# EAGLE design main (EAGLE 9.6.2)

## Sheet 1 of 2
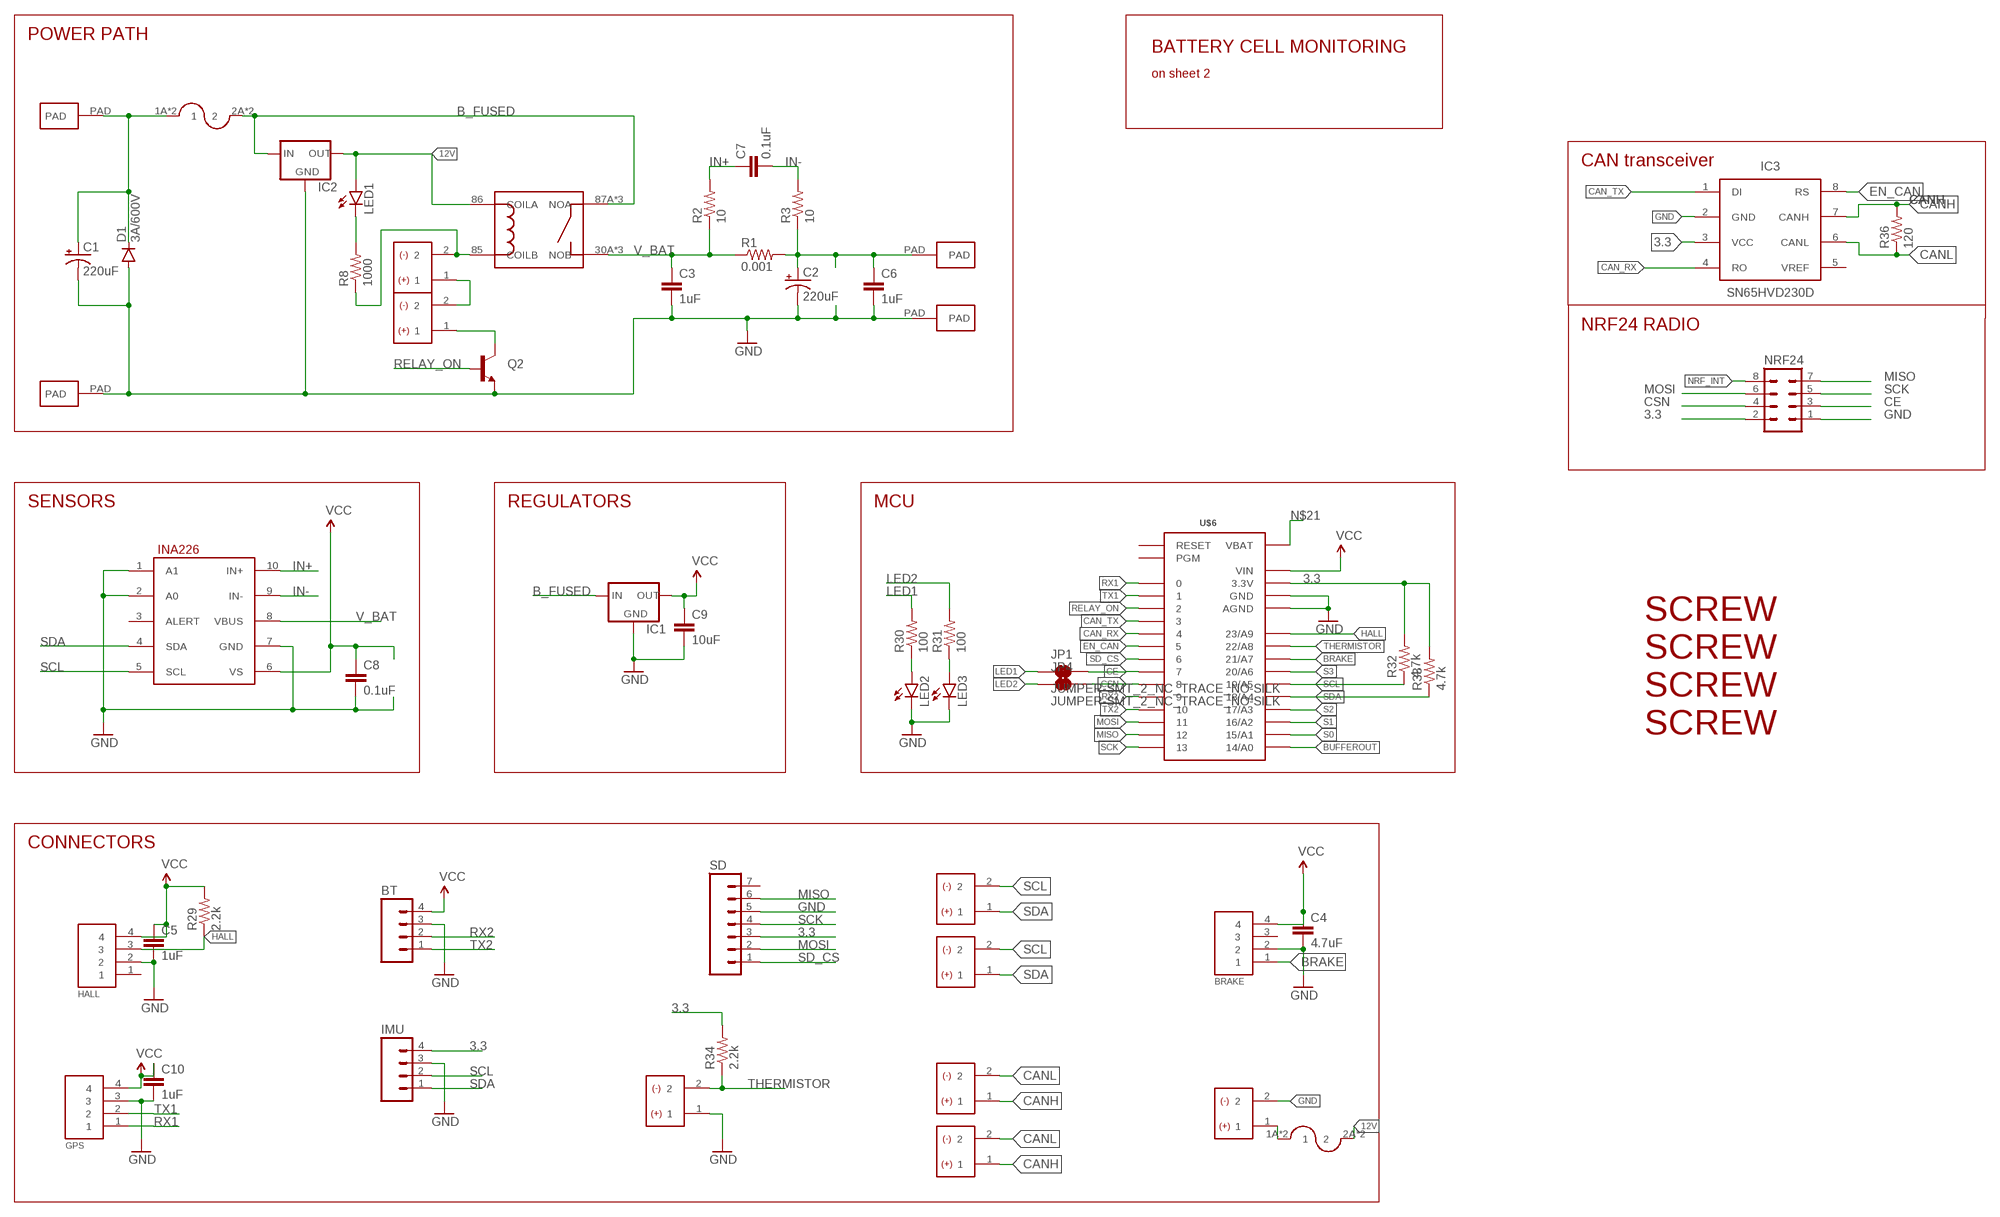
[diagram p0: schematic, sheet 1]

### Parts
12V  HEADER2  [2PINVALULOK]
BRAKE  HEADER4VALULOK  [4PINVALULOK]
BT  M04PTH  [1X04]
C1  220uF  CAP_POLPTH4  [CPOL-RADIAL-1000UF-25V]
C2  220uF  CAP_POLPTH4  [CPOL-RADIAL-1000UF-25V]
C3  1uF  CAP1206  [1206]
C4  4.7uF  CAP0603-CAP  [0603-CAP]
C5  1uF  CAP0603-CAP  [0603-CAP]
C6  1uF  CAP1206  [1206]
C7  0.1uF  CAP0603-CAP  [0603-CAP]
C8  0.1uF  CAP0603-CAP  [0603-CAP]
C9  10uF  CAP0805  [0805]
C10  1uF  CAP0603-CAP  [0603-CAP]
CAN1  HEADER2  [2PINVALULOK]
CAN2  HEADER2  [2PINVALULOK]
D1  3A/600V  DIODEES3J  [SMC]
ESTOP1  HEADER2  [2PINVALULOK]
ESTOP2  HEADER2  [2PINVALULOK]
GPS  GPS  HEADER4VALULOK  [4PINVALULOK]
HALL  HEADER4VALULOK  [4PINVALULOK]
I2C_1  HEADER2  [2PINVALULOK]
I2C_2  HEADER2  [2PINVALULOK]
IC1  V_REG_78XXSINK  [TO220-IGO]
IC2  V_REG_78XXSINK  [TO220-IGO]
IC3  SN65HVD230D  [SO-8]
IC4  INA226  [PSOP-10]
IMU  M04PTH  [1X04]
JP1  JUMPER-SMT_2_NC_TRACE_NO-SILK  [SMT-JUMPER_2_NC_TRACE_NO-SILK]
JP4  JUMPER-SMT_2_NC_TRACE_NO-SILK  [SMT-JUMPER_2_NC_TRACE_NO-SILK]
LED1  LED1206  [LED-1206]
LED2  LED1206  [LED-1206]
LED3  LED1206  [LED-1206]
NRF24  MA04-2  [MA04-2]
Q2  TRANSISTOR_NPNSMD2  [SOT223]
R1  0.001  RESISTOR2512  [R2512]
R2  10  RESISTOR0603-RES  [0603-RES]
R3  10  RESISTOR0603-RES  [0603-RES]
R8  1000  RESISTOR0603-RES  [0603-RES]
R29  2.2k  RESISTOR0603-RES  [0603-RES]
R30  100  RESISTOR0603-RES  [0603-RES]
R31  100  RESISTOR0603-RES  [0603-RES]
R32  4.7k  RESISTOR0603-RES  [0603-RES]
R33  4.7k  RESISTOR0603-RES  [0603-RES]
R34  2.2k  RESISTOR0603-RES  [0603-RES]
R36  120  RESISTOR0603-RES  [0603-RES]
SD  M07  [1X07]
TEMP  HEADER2  [2PINVALULOK]
U$2  PAD  [PAD]
U$3  PAD  [PAD]
U$4  PAD  [PAD]
U$5  PAD  [PAD]
U$6  TEENSY_3.0_BASIC  [TEENSY_3.0_BASIC]
U$7  RELAY  [PANASONIC_HP_RELAY]
U$8  FUSE  [AUTO_FUSE]
U$13  SCREW  [M3HOLE]
U$14  SCREW  [M3HOLE]
U$15  SCREW  [M3HOLE]
U$16  SCREW  [M3HOLE]
U$18  FUSE  [AUTO_FUSE]

### Nets
3.3: IC3.3(VCC) IMU.4 NRF24.2 R32.2 R33.2 R34.2 SD.3 U$6.3.3V U$6.3.3V1(3.3V)
12V: IC2.OUT LED1.A U$7.86(COILA) U$18.2A U$18.2B
B_FUSED: IC1.IN IC2.IN U$7.87A(NOA) U$7.87B(NOA) U$7.87C(NOA) U$8.2A U$8.2B
B_OUT: C2.+ C6.1 R1.2 R3.1 U$4.PAD
B_RAW: C1.+ D1.C U$2.PAD U$8.1A U$8.1B
BRAKE: BRAKE.1 U$6.21/A7
BUFFEROUT: U$6.14/A0 ; also sheet 2
CAN_RX: IC3.4(RO) U$6.4
CAN_TX: IC3.1(DI) U$6.3
CANH: CAN1.1 CAN2.1 IC3.7(CANH) R36.2
CANL: CAN1.2 CAN2.2 IC3.6(CANL) R36.1
CE: JP1.2 NRF24.3 U$6.7
CSN: JP4.2 NRF24.4 U$6.8
EN_CAN: IC3.8(RS) U$6.5
GND: 12V.2 BRAKE.2 BT.3 C1.- C2.- C3.2 C4.2 C5.2 C6.2 C8.2 C9.2 C10.2 D1.A GPS.3 HALL.2 IC1.GND IC2.GND IC3.2(GND) IC4.1(A1) IC4.2(A0) IC4.7(GND) IMU.3 LED2.C LED3.C NRF24.1 Q2.3(E) SD.5 TEMP.1 U$3.PAD U$5.PAD U$6.AGND U$6.GND U$6.GND1(GND) ; also sheet 2
HALL: HALL.3 R29.1 U$6.23/A9
IN+: C7.1 IC4.10(IN+) R2.2
IN-: C7.2 IC4.9(IN-) R3.2
LED1: JP1.1 R30.2
LED2: JP4.1 R31.2
MISO: NRF24.7 SD.6 U$6.12
MOSI: NRF24.6 SD.2 U$6.11
N$2: LED2.A R30.1
N$5: 12V.1 U$18.1A U$18.1B
N$9: LED1.C R8.2
N$10: ESTOP1.2 R8.1 U$7.85(COILB)
N$12: ESTOP1.1 ESTOP2.2
N$13: ESTOP2.1 Q2.2(C)
N$20: LED3.A R31.1
N$21: U$6.VBAT
NRF_INT: NRF24.8
RELAY_ON: Q2.1(B) U$6.2
RX1: GPS.1 U$6.0
RX2: BT.2 U$6.9
S0: U$6.15/A1 ; also sheet 2
S1: U$6.16/A2 ; also sheet 2
S2: U$6.17/A3 ; also sheet 2
S3: U$6.20/A6 ; also sheet 2
SCK: NRF24.5 SD.4 U$6.13
SCL: I2C_1.2 I2C_2.2 IC4.5(SCL) IMU.2 R32.1 U$6.19/A5
SD_CS: SD.1 U$6.6
SDA: I2C_1.1 I2C_2.1 IC4.4(SDA) IMU.1 R33.1 U$6.18/A4
THERMISTOR: R34.1 TEMP.2 U$6.22/A8
TX1: GPS.2 U$6.1
TX2: BT.1 U$6.10
V_BAT: C3.1 IC4.8(VBUS) R1.1 R2.1 U$7.30A(NOB) U$7.30B(NOB) U$7.30C(NOB)
VCC: BRAKE.4 BT.4 C4.1 C5.1 C8.1 C9.1 C10.1 GPS.4 HALL.4 IC1.OUT IC4.6(VS) R29.2 U$6.VIN ; also sheet 2
Unconnected: BRAKE.3 HALL.1 IC3.5(VREF) IC4.3(ALERT) SD.7 U$6.PGM U$6.RESET

### Notes on the sheet
- POWER PATH
- BATTERY CELL MONITORING
- on sheet 2
- CAN transceiver
- NRF24 RADIO
- SENSORS | REGULATORS | MCU
- CONNECTORS

## Sheet 2 of 2
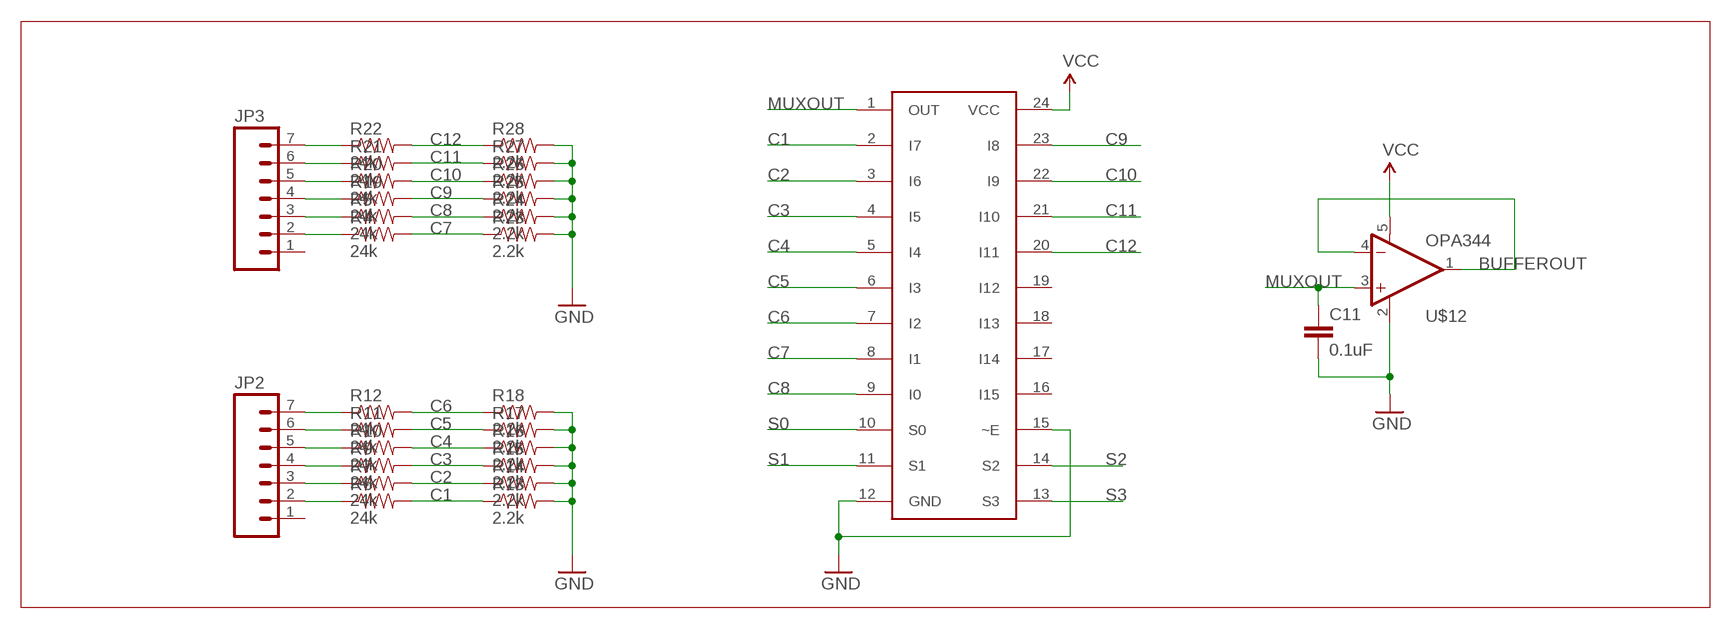
[diagram p1: schematic, sheet 2]

### Parts
C11  0.1uF  CAP0603-CAP  [0603-CAP]
JP2  M07  [1X07]
JP3  M07  [1X07]
R4  24k  RESISTOR0603-RES  [0603-RES]
R5  24k  RESISTOR0603-RES  [0603-RES]
R6  24k  RESISTOR0603-RES  [0603-RES]
R7  24k  RESISTOR0603-RES  [0603-RES]
R9  24k  RESISTOR0603-RES  [0603-RES]
R10  24k  RESISTOR0603-RES  [0603-RES]
R11  24k  RESISTOR0603-RES  [0603-RES]
R12  24k  RESISTOR0603-RES  [0603-RES]
R13  2.2k  RESISTOR0603-RES  [0603-RES]
R14  2.2k  RESISTOR0603-RES  [0603-RES]
R15  2.2k  RESISTOR0603-RES  [0603-RES]
R16  2.2k  RESISTOR0603-RES  [0603-RES]
R17  2.2k  RESISTOR0603-RES  [0603-RES]
R18  2.2k  RESISTOR0603-RES  [0603-RES]
R19  24k  RESISTOR0603-RES  [0603-RES]
R20  24k  RESISTOR0603-RES  [0603-RES]
R21  24k  RESISTOR0603-RES  [0603-RES]
R22  24k  RESISTOR0603-RES  [0603-RES]
R23  2.2k  RESISTOR0603-RES  [0603-RES]
R24  2.2k  RESISTOR0603-RES  [0603-RES]
R25  2.2k  RESISTOR0603-RES  [0603-RES]
R26  2.2k  RESISTOR0603-RES  [0603-RES]
R27  2.2k  RESISTOR0603-RES  [0603-RES]
R28  2.2k  RESISTOR0603-RES  [0603-RES]
U$11  CD74HC4067  [SO-24DW]
U$12  OPA344  [SOT23-5]

### Nets
BUFFEROUT: U$12.1(OUT) U$12.4(-IN) ; also sheet 1
C1: R6.2 R13.1 U$11.2(I7)
C2: R7.2 R14.1 U$11.3(I6)
C3: R9.2 R15.1 U$11.4(I5)
C4: R10.2 R16.1 U$11.5(I4)
C5: R11.2 R17.1 U$11.6(I3)
C6: R12.2 R18.1 U$11.7(I2)
C7: R4.2 R23.1 U$11.8(I1)
C8: R5.2 R24.1 U$11.9(I0)
C9: R19.2 R25.1 U$11.23(I8)
C10: R20.2 R26.1 U$11.22(I9)
C11: R21.2 R27.1 U$11.21(I10)
C12: R22.2 R28.1 U$11.20(I11)
GND: C11.2 R13.2 R14.2 R15.2 R16.2 R17.2 R18.2 R23.2 R24.2 R25.2 R26.2 R27.2 R28.2 U$11.12(GND) U$11.15(~E) U$12.2(V-) ; also sheet 1
MUXOUT: C11.1 U$11.1(OUT) U$12.3(+IN)
N$1: JP2.7 R12.1
N$3: JP2.6 R11.1
N$4: JP2.5 R10.1
N$6: JP2.4 R9.1
N$8: JP2.3 R7.1
N$11: JP2.2 R6.1
N$14: JP3.7 R22.1
N$15: JP3.6 R21.1
N$16: JP3.5 R20.1
N$17: JP3.4 R19.1
N$18: JP3.3 R5.1
N$19: JP3.2 R4.1
S0: U$11.10(S0) ; also sheet 1
S1: U$11.11(S1) ; also sheet 1
S2: U$11.14(S2) ; also sheet 1
S3: U$11.13(S3) ; also sheet 1
VCC: U$11.24(VCC) U$12.5(V+) ; also sheet 1
Unconnected: JP2.1 JP3.1 U$11.16(I15) U$11.17(I14) U$11.18(I13) U$11.19(I12)

## Library data of the parts
12V CAN1 CAN2 ESTOP1 ESTOP2 I2C_1 I2C_2 TEMP = Custom_old:HEADER2
BRAKE GPS HALL = Custom_old:HEADER4
BT IMU = SparkFun-Connectors:M04: Header 4 Standard 4-pin 0.1" header. Use with straight break away headers (SKU : PRT-00116), right angle break away headers (PRT-00553), swiss pins (PRT-00743), machine pins (PRT-00117), and female headers (PRT-00115). Molex polarized connector foot print use with SKU : PRT-08231 with associated crimp pins and housings. 1MM SMD Version SKU: PRT-10208
C1 C2 = SparkFun-Capacitors:CAP_POL: Capacitor Polarized These are standard SMD and PTH capacitors. Normally 10uF, 47uF, and 100uF in electrolytic and tantalum varieties. Always verify the external diameter of the through hole cap, it varies with capacity, voltage, and manufacturer. The EIA devices should be standard.
C3 C6 = SparkFun-Capacitors:CAP: Capacitor Standard 0603 ceramic capacitor, and 0.1" leaded capacitor.
C4 C5 C7-C11 = SparkFun-Passives:CAP: Capacitor Standard 0603 ceramic capacitor, and 0.1" leaded capacitor.
D1 = SparkFun-DiscreteSemi:DIODE: Diode These are standard reverse protection diodes and small signal diodes. SMA package can handle up to about 1A. SOD-323 can handle about 200mA. What the SOD-323 package when ordering, there are some mfgs out there that are 5-pin packages.; PROD_ID: DIO-12441
IC1 IC2 = SparkFun-PowerIC:V_REG_78XX: Voltage Regulator Standard 7805 5V regulator. IGO (Input Ground Output). Spark Fun Electronics SKU : COM-00107
IC3 = Misaka-IC:SN65HVD23*D: 3.3V CAN Bus Transceiver Supply voltage: 3...3.6V Max rate: 1Mbps Standby mode(SN65HVD230D) Sleep mode(SN65HVD231D) Slope control mode
IC4 = Custom_old:INA226
JP1 JP4 = SparkFun-Jumpers:JUMPER-SMT_2_NC_TRACE: Normally closed trace jumper This jumper has a trace between two pads so it's normally closed (NC). Use a razor knife to open the connection. For best results follow the IPC guidelines for cutting traces: Cutout at least 0.063 mm (0.005 in). Remove all loose material to clean up the cut area. Seal the cut with an approved epoxy. Reapply solder to reclose the connection.
JP2 JP3 SD = SparkFun-Connectors:M07: Header 7 Standard 7-pin 0.1" header. Use with straight break away headers (SKU : PRT-00116), right angle break away headers (PRT-00553), swiss pins (PRT-00743), machine pins (PRT-00117), and female headers (PRT-00115). NOTES ON THE VARIANTS LOCK and LOCK_LONGPADS... This footprint was designed to help hold the alignment of a through-hole component (i.e. 7-pin header) while soldering it into place. You may notice that each hole has been shifted either up or down by 0.005 of an inch from it's more standard position (which is usually a perfectly straight line). This slight alteration caused the pins (the squares in the middle) to touch the edges of the holes. Because they are alternating, it causes a "brace" to hold the header in place. 0.005 has proven to be the perfect amount of "off-center" position when using our standard breakaway headers. Although looks a little odd when you look at the bare footprint, once you have a header in there, the alteration is very hard to notice. Also, if you push a header all the way into place, it is covered up entirely on the bottom side. This idea of altering the position of holes to aid alignment will be further integrated into the Sparkfun Library for other footprints. It can help hold any component with 3 or more connection pins.
LED1-LED3 = SparkFun-LED:LED: LEDs Standard schematic elements and footprints for 5mm, 3mm, 1206, and 0603 sized LEDs. 5mm - Spark Fun Electronics SKU : COM-00529 (and others)
NRF24 = con-lstb:MA04-2: PIN HEADER; OC_FARNELL: unknown; OC_NEWARK: unknown
Q2 = SparkFun-DiscreteSemi:TRANSISTOR_NPN: Generic NPN BJT MMBT2222A - TRANS-08049 (SOT-23, 1A 40V) MPSA42 - TRANS-09116 (SOT-23, 500mA 300V) MMBT5088LT1G - TRANS-11160 (SOT-23, 50 mA 30V) BC547 - COM-08928 <http://www.sparkfun.com/products/8928> (TO-92 45V 100mA) (1.Collector 2.Base 3.Emitter) 2N3904 - COM-00521 <http://www.sparkfun.com/products/521> (TO-92 40V 200mA) (1.Emitter 2.Base 3.Collector) P2N2222A - COM-12852 <http://www.sparkfun.com/products/12852> (TO-92 40V 600mA) (1.Collector 2.Base 3.Emitter)
R1 = SparkFun-Resistors:RESISTOR: Resistor Basic schematic elements and footprints for 0603, 1206, and PTH resistors.
R2-R34 R36 = SparkFun-Passives:RESISTOR: Resistor Basic schematic elements and footprints for 0603, 1206, and PTH resistors.
U$2-U$5 = Custom_old:PAD
U$6 = Teensy3.0:TEENSY_3.0_BASIC: Basic Teensy 3.0 with none of the 'inner' pins enabled. See '+4', 'AllAnalogPins", and 'AllPins' packages for additional pin holes, as needed.
U$7 = Custom_old:RELAY
U$8 U$18 = Custom_old:FUSE
U$11 = Custom_old:CD74HC4067
U$12 = SparkFun-AnalogIC:OPA344: Single gate rail-to-rail output op-amp. Inputs extend 300mV past rails.
U$13-U$16 = Custom_old:SCREW

## Module BATTERY_CELLS
Ports: 

### Library data of the parts

## Board
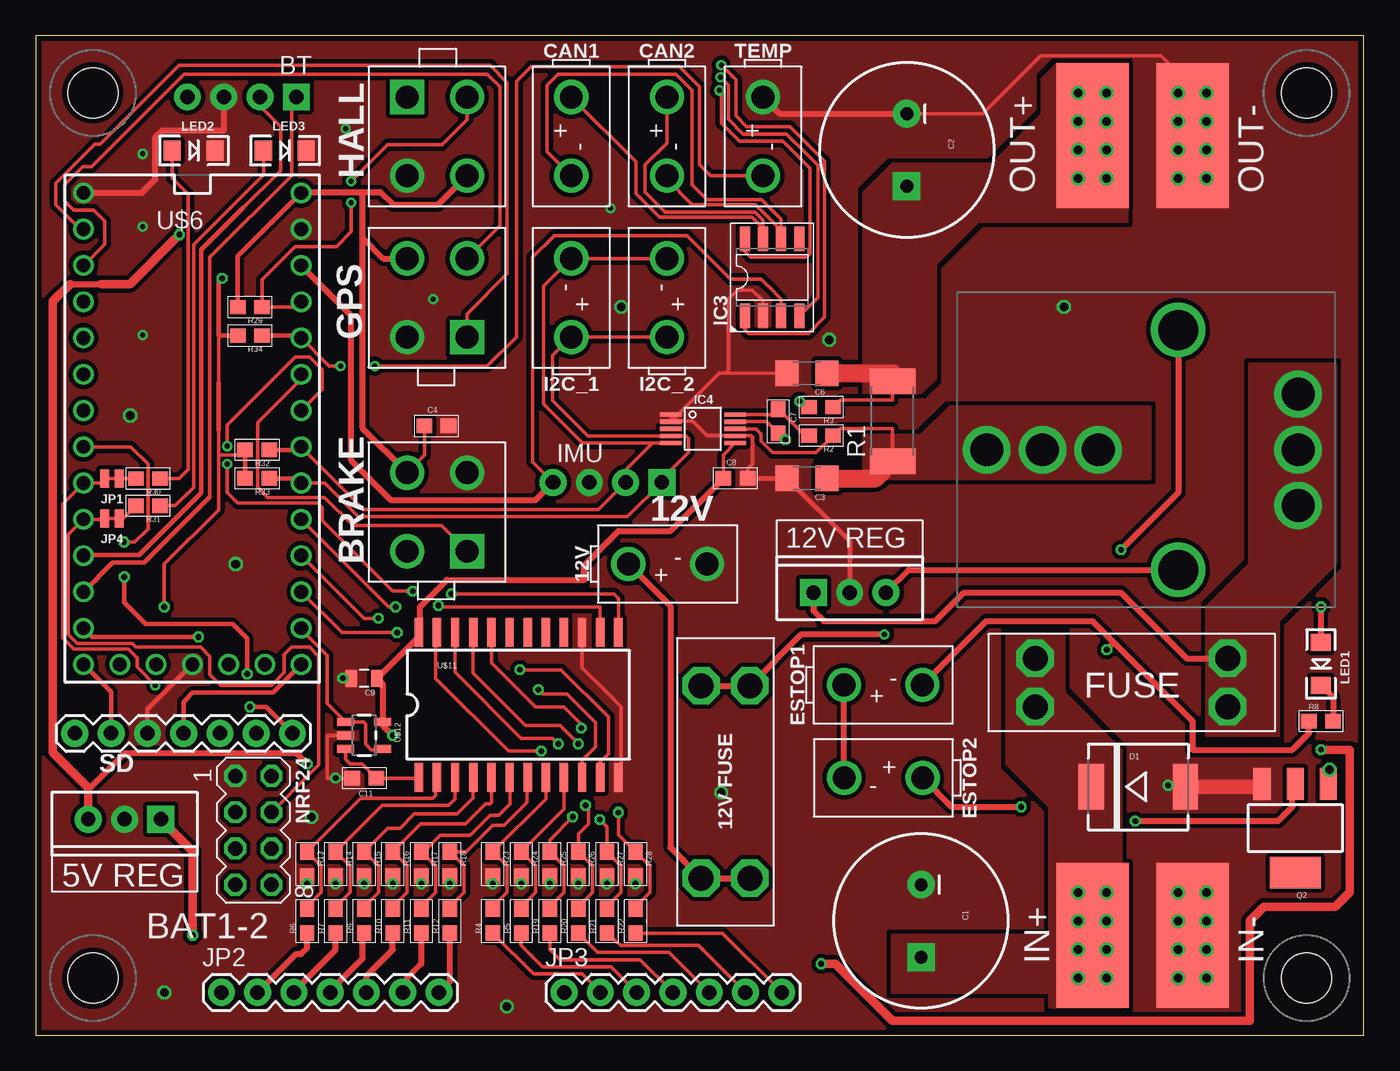
[diagram p2: board, top side]
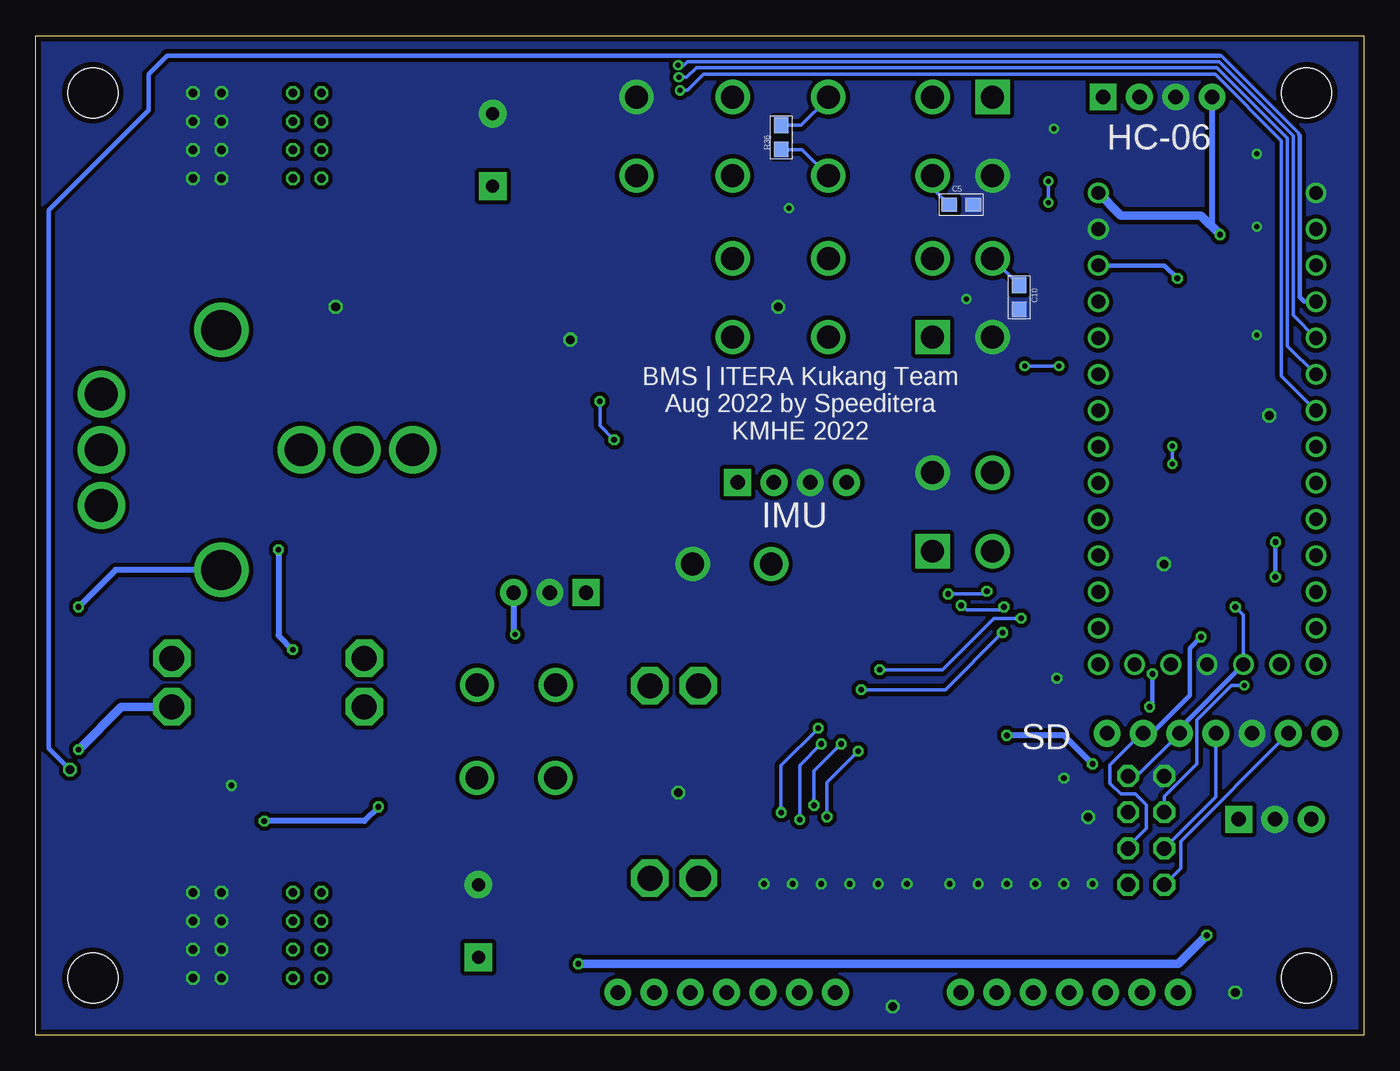
[diagram p3: board, bottom side, seen from below]

Size 93 x 70 mm. Coordinates in mm from the lower left corner, seen from the top.
Outline: 0,0 93,0 93,70 0,70 0,0
Copper layers (1*16): Top 0.0356mm / dielectric 1.5011mm / Bottom 0.0356mm
Design rules "jlcpcb_tented *": minimum track width 5mil, minimum drill 13mil, track to track 5mil, track to pad 5mil, pad to pad 5mil, via to via 5mil, smd to smd 5mil, copper to edge 15mil, drill to drill 6mil, minimum pad ring 7mil, minimum via ring 7mil, stop-mask expansion 2.5mil, vias tented up to drill 0.6mm, thermal gap 10mil

### Footprints (pad centres in the part's own frame; a part is rotated, then mirrored left to right if it is on the bottom)
2PINVALULOK = drill 1.6: 1 0,5.5; 2 0,0
4PINVALULOK = drill 1.6 square: 1 0,5.5 | drill 1.6: 2 0,0; 3 4.2,5.5; 4 4.2,0
1X04 = drill 1.016 pad 1.88 square: 1 0,0 | drill 1.016 pad 1.88: 2 2.54,0; 3 5.08,0; 4 7.62,0
CPOL-RADIAL-1000UF-25V = drill 0.9 pad 1.93 square: + 2.54,0 | drill 0.9 pad 1.93: - -2.54,0
1206 = smd 1.6 x 1.8: 1 -1.4,0; 2 1.4,0
0603-CAP = smd 1.1 x 1: 1 -0.85,0; 2 0.85,0
0805 = smd 0.8 x 1.2: 1 -0.9,0; 2 0.9,0
SMC = smd 1.778 x 3.175: A 3.302,0; C -3.302,0
TO220-IGO = drill 1 pad 1.88: GND 0,0; OUT 2.54,0 | drill 1 pad 1.88 square: IN -2.54,0
SO-8 = smd 1.7 x 0.7: 1 -2.7,1.905; 2 -2.7,0.635; 3 -2.7,-0.635; 4 -2.7,-1.905; 5 2.7,-1.905; 6 2.7,-0.635; 7 2.7,0.635; 8 2.7,1.905
PSOP-10 = smd 1.5 x 0.3: 1 0,1; 2 0,0.5; 3 0,0; 4 0,-0.5; 5 0,-1; 6 4.5,-1; 7 4.5,-0.5; 8 4.5,0; 9 4.5,0.5; 10 4.5,1
SMT-JUMPER_2_NC_TRACE_NO-SILK = smd 0.635 x 1.27: 1 -0.508,0; 2 0.508,0
1X07 = drill 1.016 pad 1.88: 1 0,0; 2 2.54,0; 3 5.08,0; 4 7.62,0; 5 10.16,0; 6 12.7,0; 7 15.24,0
LED-1206 = smd 1.2 x 1.4: A -1.5,0; C 1.5,0
MA04-2 = drill 1.016 octagon: 1 -3.81,-1.27; 2 -3.81,1.27; 3 -1.27,-1.27; 4 -1.27,1.27; 5 1.27,-1.27; 6 1.27,1.27; 7 3.81,-1.27; 8 3.81,1.27
SOT223 = smd 1.219 x 2.235: 1 -2.311,-3.099; 2 0,-3.099; 3 2.311,-3.099 | smd 3.6 x 2.2: 4 0,3.099
R2512 = smd 1.8 x 3.2: 1 -2.8,0; 2 2.8,0
0603-RES = smd 1.1 x 1: 1 -0.85,0; 2 0.85,0
PAD = smd 10.16 x 5.08: PAD 0,0
TEENSY_3.0_BASIC = drill 0.965: 0 -7.62,13.97; 1 -7.62,11.43; 2 -7.62,8.89; 3 -7.62,6.35; 3.3V 7.62,11.43; 3.3V1 -2.54,-16.51; 4 -7.62,3.81; 5 -7.62,1.27; 6 -7.62,-1.27; 7 -7.62,-3.81; 8 -7.62,-6.35; 9 -7.62,-8.89; 10 -7.62,-11.43; 11 -7.62,-13.97; 12 -7.62,-16.51; 13 7.62,-16.51; 14/A0 7.62,-13.97; 15/A1 7.62,-11.43; 16/A2 7.62,-8.89; 17/A3 7.62,-6.35; 18/A4 7.62,-3.81; 19/A5 7.62,-1.27; 20/A6 7.62,1.27; 21/A7 7.62,3.81; 22/A8 7.62,6.35; 23/A9 7.62,8.89; AGND 7.62,13.97; GND -7.62,16.51; GND1 0,-16.51; PGM 2.54,-16.51; RESET 5.08,-16.51; VBAT -5.08,-16.51; VIN 7.62,16.51
PANASONIC_HP_RELAY = drill 2.3: 30A 5.6,0; 30B 9.5,0; 30C 13.4,0; 87A -8.4,3.9; 87B -8.4,0; 87C -8.4,-3.9 | drill 2.8: 85 0,-8.4; 86 0,8.4
AUTO_FUSE = drill 1.75 octagon: 1A 0,3.4; 1B 0,0; 2A 13.47,3.4; 2B 13.47,0
SO-24DW = smd 0.584 x 2.032: 1 -6.35,-5.08; 2 -5.08,-5.08; 3 -3.81,-5.08; 4 -2.54,-5.08; 5 -1.27,-5.08; 6 0,-5.08; 7 1.27,-5.08; 8 2.54,-5.08; 9 3.81,-5.08; 10 5.08,-5.08; 11 6.35,-5.08; 12 7.62,-5.08; 13 7.62,5.08; 14 6.35,5.08; 15 5.08,5.08; 16 3.81,5.08; 17 2.54,5.08; 18 1.27,5.08; 19 0,5.08; 20 -1.27,5.08; 21 -2.54,5.08; 22 -3.81,5.08; 23 -5.08,5.08; 24 -6.35,5.08
SOT23-5 = smd 0.55 x 1.2: 1 -0.95,-1.3; 2 0,-1.3; 3 0.95,-1.3; 4 0.95,1.3; 5 -0.95,1.3
M3HOLE = hole 3.5: 0,0

### Placement (x,y rotation side)
12V  47,33 90 top
BRAKE  30.2,39.4 180 top
BT  18.25,65.71 180 top
C1  62,8 270 top
C2  61,62 270 top
C3  54,39 180 top
C4  28.07,42.67 0 top
C5  28.19,58.17 0 bottom
C6  54,46.37 180 top
C7  52,43 270 top
C8  49,39 0 top
C9  23,25 180 top
C10  24.13,51.69 270 bottom
C11  23,18 180 top
CAN1  37.5,60.2 0 top
CAN2  44.2,60.2 0 top
D1  77.2,17.4 0 top
ESTOP1  62.09,24.53 90 top
ESTOP2  56.61,18.02 270 top
GPS  30.2,54.4 180 top
HALL  26,60.2 0 top
I2C_1  37.5,54.4 180 top
I2C_2  44.2,54.4 180 top
IC1  6.22,15.13 180 top
IC2  57,31 0 top
IC3  51.56,53.07 90 top
IC4  44.47,42.47 0 top
IMU  43.85,38.71 180 top
JP1  5.33,38.99 180 top
JP2  13,3 0 top
JP3  37,3 0 top
JP4  5.33,36.2 180 top
LED1  90,26 270 top
LED2  11.07,61.95 0 top
LED3  17.45,61.95 0 top
NRF24  15.24,14.35 270 top
Q2  88.2,14.5 180 top
R1  60,43 90 top
R2  55,42 180 top
R3  55,44 180 top
R4  32,8 90 top
R5  34,8 90 top
R6  19,8 90 top
R7  21,8 90 top
R8  90,22 0 top
R9  23,8 90 top
R10  25,8 90 top
R11  27,8 90 top
R12  29,8 90 top
R13  19,12 270 top
R14  21,12 270 top
R15  23,12 270 top
R16  25,12 270 top
R17  27,12 270 top
R18  29,12 270 top
R19  36,8 90 top
R20  38,8 90 top
R21  40,8 90 top
R22  42,8 90 top
R23  32,12 270 top
R24  34,12 270 top
R25  36,12 270 top
R26  38,12 270 top
R27  40,12 270 top
R28  42,12 270 top
R29  15,51 180 top
R30  7.87,38.99 180 top
R31  7.87,37.08 180 top
R32  15.51,41 180 top
R33  15.51,39 180 top
R34  15,49 180 top
R36  40.8,62.88 90 bottom
SD  17.98,21.14 180 top
TEMP  50.93,60.2 0 top
U$2  74,7 90 top
U$3  81,63 90 top
U$4  74,63 90 top
U$5  81,7 90 top
U$6  10.97,42.48 0 top
U$7  80,41 180 top
U$8  70,23 0 top
U$11  33.18,23.13 0 top
U$12  23,21 270 top
U$13  89,4 0 top
U$14  89,66 0 top
U$15  4,66 0 top
U$16  4,4 0 top
U$17  [DEV]  68.58,48.26 0 bottom
U$18  50,11 90 top

### Tracks (layer width: path | path; a pad name or v marks a point on that pad's centre or on a via)
3.3  (via drill 0.4)
  Top 0.254: v9,30 9,33 12.8,36.8 12.8,40.64 | 12.8,45.72 12.8,48.8 13,49 | IC3.3 52.2,51.56 51.88,51.88 51.69,52.07 50.8,52.96 48.64,52.96 45.59,56.01 36.32,56.01 34.8,54.48 34.8,40.14 IMU.4 | 12.8,40.64 12.8,42.35 | 14.66,40.64 12.8,40.64
  Top 0.305: 13.05,49 R34.2 | R33.2 14.66,40.64 R32.2 | 12.8,42.35 12.8,43.18 12.8,45.72 | 13,49 13.05,49 | v13.05,53.01 12.8,52.75 12.8,49 13.05,49
  Top 0.406: U$6.3.3V 22.1,50.4 22.1,40.26 24.89,37.47 34.98,37.47 IMU.4
  Bottom 0.254: U$6.3.3V1 8.43,29.43 v9,30 | SD.3 15.88,18.16 NRF24.2
  Bottom 0.305: U$6.3.3V 13.96,53.91 v13.05,53.01 | SD.3 12.9,21.5 U$6.3.3V1
12V  (via drill 0.35, 0.4)
  Top 0.406: v90,30 LED1.A | IC2.OUT 61.14,32.6 U$7.86 | U$18.2A U$18.2B 53.6,28.07 v59.44,28.07
  Bottom 0.406: U$7.86 87.4,32.6 v90,30 | IC2.OUT 59.54,28.17 v59.44,28.07
B_FUSED  (via drill 0.4)
  Top 0.406: U$8.2A 80.6,26.4 76,31 65,31 63,29 55.19,29 54.46,29.73 IC2.IN
  Top 0.61: IC1.IN 11,12.89 v11,7 | v90,20 92,20 92,10 91,9 86,9 85,8 85,1 60,1 56,5 v55,5
  Bottom 0.61: v90,20 87,23 U$8.2B | v11,7 13,5 v55,5
  pour Top (isolate 0.305, no thermals): 82,29 82,21 87,21 87,29 91,33 91,47 85,47 85,33 82,30
B_OUT  (via drill 0.6)
  Top 0.254: R3.1 56.35,44.5 60,44.5 R1.2 60,46.37
  Top 1.27: C6.1 60,46.37
  other vias: 73,60 75,60 75,62 73,62 75,64 73,64 73,66 75,66
  pour Top (isolate 0.305, no thermals): 58,45 62,45 63,46 63,54 66,57 76,57 76.4,57 76.4,68 71.5,68 70.5,67 70.5,64.5 67,61 60,61 58,59
B_RAW  (via drill 0.6)
  other vias: 73,10 75,10 73,4 75,4 75,6 73,6 73,8 75,8
  pour Top (isolate 0.305, no thermals): 76,2 76,20 72,24 72,28 68,28 68,19 71,16 71,2
  pour Top (isolate 0.305, no thermals): 60,7 60,3 76,3 76,8 75,7
BRAKE
  Top 0.254: BRAKE.1 28.41,35.69 27.3,35.69 22.23,35.69 20.25,37.67 16.25,37.67 15.53,38.38 15.53,42.89 18.59,45.95 U$6.21/A7
BUFFEROUT
  Top 0.254: U$12.4 24.25,20 23.5,20 23.1,20.4 23.1,21.8 22.95,21.95 U$12.1 20.4,23.25 20.4,26.6 18.59,28.41 U$6.14/A0
C1
  Top 0.254: R6.2 19,9 20,10 20,11.85 R13.1 22.75,16.6 27.8,16.6 28,16.8 28,17.95 U$11.2
C2
  Top 0.254: R7.2 21,9 22,10 22,11.85 R14.1 24.25,16.1 28.9,16.1 29.37,16.57 U$11.3
C3
  Top 0.254: R9.2 23,9 24,10 24,11.85 R15.1 24.65,14.5 25.5,14.5 26.5,15.5 29.5,15.5 30.64,16.64 U$11.4
C4
  Top 0.254: R10.2 25,9 26,10 26,11.85 R16.1 26.95,14.8 30.1,14.8 31.5,16.2 31.8,16.2 31.91,16.31 U$11.5
C5
  Top 0.254: R11.2 27,9 28,10 28,11.85 R17.1 27.15,12.85 28.3,14 30.4,14 31.8,15.4 32.4,15.4 33.2,16.2 33.2,18.03 U$11.6
C6
  Top 0.254: R12.2 29,9 30,10 30,11.85 R18.1 30.15,12.85 32,14.7 32.8,14.7 34.4,16.3 34.4,18 U$11.7
C7
  Top 0.254: R4.2 32,9 33,10 33,11.85 R23.1 35.72,16.57 U$11.8
C8
  Top 0.254: R5.2 34,9 35,10 35,11.85 R24.1 36.99,15.84 U$11.9
C9  (via drill 0.4)
  Top 0.254: R19.2 36,9 37,10 37,11.85 R25.1 36,13.7 v37.6,15.3 | v35.4,19.9 33.1,19.9 28,25 28,28.11 U$11.23
  Bottom 0.254: v37.6,15.3 37.6,17.7 v35.4,19.9
C10  (via drill 0.4)
  Top 0.254: R20.2 38,9 39,10 39,11.85 R26.1 38,14.1 38.7,14.8 38.7,15.9 v38.5,16.1 | v36.6,20.4 36.2,20.8 34,20.8 29.37,25.43 U$11.22
  Bottom 0.254: v38.5,16.1 38.5,18.5 v36.6,20.4
C11  (via drill 0.4)
  Top 0.254: R21.2 40,9 41,10 41,11.85 R27.1 40,14.6 v39.5,15.1 | U$11.21 30.64,25.36 34.3,21.7 36.7,21.7 v38,20.4
  Bottom 0.254: v38,20.4 39.5,18.9 v39.5,15.1
C12  (via drill 0.4)
  Top 0.254: R22.2 42,9 43,10 43,11.85 R28.1 40.8,14.05 v40.8,15.6 | v38.2,21.5 38.2,21.8 37,23 35,23 31.91,26.09 U$11.20
  Bottom 0.254: v40.8,15.6 40.8,18.9 v38.2,21.5
CAN_RX  (via drill 0.35)
  Top 0.254: v47.97,67.08 48.51,66.54 48.51,64.14 49.53,63.12 52.58,63.12 54.04,61.66 54.76,60.94 54.76,51.66 IC3.4
  Bottom 0.254: U$6.4 3.37,46.29 5.36,48.28 5.36,62.83 10.29,67.76 46.74,67.76 47.41,67.08 v47.97,67.08
CAN_TX  (via drill 0.35)
  Top 0.254: v48.01,67.94 49.02,66.93 49.02,64.39 49.78,63.63 52.83,63.63 55.24,61.21 55.24,50.29 54.1,49.15 49.91,49.15 49.66,49.4 IC3.1
  Bottom 0.254: U$6.3 4.95,50.43 4.95,62.69 | 4.95,62.69 | 4.95,62.69 4.95,63 10.12,68.17 10.16,68.17 47.37,68.17 47.6,67.94 v48.01,67.94
CANH
  Top 0.254: CAN1.1 42.04,61.16 42.04,58.93 43.69,57.28 50.16,57.28 50.93,56.51 | 50.93,56.51 50.93,56.77 50.93,57.08 50.35,57.66 44.07,57.66 42.67,59.05 42.67,60.96 44.2,62.49 CAN2.1 | 50.93,56.51 50.93,56.13 IC3.7
  Bottom 0.254: CAN1.1 37.5,65.63 39.4,63.73 R36.2
CANL
  Top 0.254: IC3.6 52.2,56.26 | CAN2.2 44.2,59.94 45.97,58.17 50.42,58.17 52.2,56.39 52.2,56.26 | CAN1.2 35.81,61.89 35.81,66.55 36.58,67.31 44.83,67.31 45.97,66.17 45.97,59.56 47.02,58.52 50.83,58.52 52.2,57.15 52.2,56.26
  Bottom 0.254: CAN1.2 39.33,62.03 R36.1
CE  (via drill 0.35)
  Top 0.254: JP1.2 4.51,38.67 U$6.7 1.89,37.21 1.89,27.83 2.67,27.05 6.48,27.05 7.11,26.42 7.11,25.78 v8.38,24.51
  Bottom 0.254: NRF24.3 13.97,16.72 11.71,18.99 11.71,22.08 9.27,24.51 v8.38,24.51
CSN
  Top 0.254: JP4.2 4.76,36.13 U$6.8 2.29,35.07 2.29,28.07 2.92,27.43 6.76,27.43 7.02,27.18 11.56,27.18 12.19,26.54 12.19,25.27 12.95,24.51 16.51,24.51 17.4,25.4 17.4,26.67 17.91,27.18 19.18,27.18 19.81,26.54 19.81,18.92 19.26,18.37 NRF24.4
EN_CAN  (via drill 0.35)
  Top 0.254: v47.88,66.17 48.01,66.04 48.01,63.88 49.28,62.61 52.32,62.61 54.23,60.71 54.23,54.74 53.98,54.48 50.04,54.48 49.66,54.86 IC3.8
  Bottom 0.254: U$6.5 5.77,46.17 5.77,62.66 10.41,67.31 46.23,67.31 47.37,66.17 v47.88,66.17
GND  (via drill 0.35, 0.4, 0.6)
  Top 0.254: 48.26,46.37 47.87,46.37 IC4.2 IC4.1 44.53,43.47 45,43 46,43 47,42 48.94,42 IC4.7 49,42 50.1,42 50.2,41.9 50.2,40 49.85,39.65 C8.2 | 48.26,46.37 C6.2 | U$11.15 38.26,25.74 40,24 41,23 41,18.25 U$11.12 | R13.2 v19,10.6 | R14.2 v21,10.6 | R15.2 v23,10.6 | R16.2 v25,10.6 | R17.2 v27,10.6 | R18.2 v29,10.6 | R23.2 v32,10.6 | R24.2 v34,10.6 | R25.2 v36,10.6 | R26.2 v38,10.6 | R27.2 v40,10.6 | R28.2 v42,10.6 | U$12.2 20.4,21 20.4,18 v21,18 C11.2 | C9.2 v21.5,25 | C2.- 66.34,64.54 70.4,68.6 78.8,68.6 81.4,66 81.4,63.4 U$3.PAD | v80,6 80.5,6.5 80.5,7 | IC3.2 50.93,51.43 50.16,52.2 49.15,52.2 48.51,51.56 48.51,46.62 48.26,46.37
  Top 0.305: SD.5 7.82,22.82 U$6.GND1 | IC2.GND 57,34.6 C3.2 C8.2
  Top 0.406: TEMP.1 52.09,64.54 C2.- | D1.A 80.4,17.5 v79.3,17.5 | BT.3 13.17,63.5 13.17,63.37 8.88,63.37 8.38,62.88 8.38,59.94 7.43,58.99 U$6.GND
  Top 1.016: U$5.PAD 80.5,7 | D1.A 85.99,17.4 Q2.3
  other vias: 80,10 80,8 80,4 82,4 82,6 82,8 82,10 41,51 55.56,48.71 72,51 14,33 19.3,15.29 9,3 33,2 48,17 6.62,43.4 80,60 82,60 80,62 82,62 82,64 80,64 80,66 82,66 21.72,63.5 7.49,61.72 7.49,56.64 7.49,49.02 27.81,51.56 40.26,57.91
  pour Bottom (isolate 0.305, no thermals): -2,72 -2,-2 95,-2 95,72
  pour Top (isolate 0.305, rank 6, no thermals): 0,70 0,0 93,0 93,70
HALL  (via drill 0.35)
  Top 0.254: v22.1,59.82 24.64,62.36 28.45,62.36 30.2,64.11 HALL.3 | U$6.23/A9 18.22,51 R29.1 15.85,52.93 18.16,55.24 21.08,55.24 22.1,56.26 v22.1,58.29
  Bottom 0.254: v22.1,59.82 v22.1,58.29
IN+
  Top 0.254: IC4.10 51.62,43.47 C7.1 53.85,42 R2.2
IN-  (via drill 0.4)
  Top 0.254: IC4.9 51.18,42.97 C7.2 52.45,41.7 v52.5,41.7 | R3.2 53.9,44 v53.5,44.4
  Bottom 0.254: v53.5,44.4 53.5,42.7 v52.5,41.7
LED1
  Top 0.254: JP1.1 R30.2
LED2
  Top 0.254: R31.2 6.13,36.2 JP4.1
MISO
  Top 0.305: SD.6 5.28,24.04 U$6.12
  Bottom 0.254: SD.6 12.83,13.59 12.83,11.68 NRF24.7
MOSI  (via drill 0.4)
  Top 0.305: U$6.11 3.96,27.9 v11.4,27.9
  Bottom 0.254: NRF24.6 16.51,13.21 15.24,14.48 15.24,16.13 16,16.89 17.02,16.89 17.78,17.65 17.78,18.92 15.56,21.14 SD.2
  Bottom 0.305: SD.2 14.86,21.14 12.2,23.8 12.2,27.1 v11.4,27.9
MUXOUT
  Top 0.254: U$11.1 26.78,18 C11.1 22.85,19 22,19 21.7,19.3 U$12.3
N$1
  Top 0.406: JP2.7 29,3.76 R12.1
N$2
  Top 0.254: LED2.A 9.57,60.03 10.69,58.9 10.69,55.8 10.67,55.77 10.67,39.62 10.03,38.99 R30.1
N$3
  Top 0.406: R11.1 27,5 26,4 26,3.3 JP2.6
N$4
  Top 0.406: JP2.5 23.16,4.16 25,6 R10.1
N$5
  Top 0.406: 12V.1 44.45,30.05 44.45,13.15 U$18.1A U$18.1B
N$6
  Top 0.406: JP2.4 20.62,3.12 22.9,5.4 22.9,7.05 R9.1
N$8
  Top 0.406: JP2.3 18.08,3.08 21,6 R7.1
N$9
  Top 0.406: LED1.C 90.85,23.65 R8.2
N$10  (via drill 0.4)
  Top 0.406: ESTOP1.2 66.56,29 74,29 75.5,27.5 | 75.5,27.5 81,22 81,20 88,20 89.15,21.15 R8.1 | U$7.85 80,38 v76,34 | v75,27 75.5,27.5
  Bottom 0.406: v76,34 76,28 v75,27
N$11
  Top 0.406: JP2.2 18.24,5.7 18.6,5.7 19,6.1 R6.1
N$12
  Top 0.406: ESTOP2.2 56.59,18.04 ESTOP1.1
N$13  (via drill 0.4)
  Top 0.406: ESTOP2.1 64.13,16 v69,16 | Q2.2 88,17.4 88,16 87,15 v77,15
  Bottom 0.406: v69,16 70,15 v77,15
N$14
  Top 0.254: JP3.7 48.09,7.15 R22.1
N$15
  Top 0.254: R21.1 40.95,6.3 46.4,6.3 JP3.6
N$16
  Top 0.254: R20.1 39.35,5.8 44.36,5.8 JP3.5
N$17
  Top 0.254: R19.1 36,6 36.7,5.3 42.32,5.3 JP3.4
N$18
  Top 0.254: R5.1 34,6.3 35.5,4.8 40.28,4.8 JP3.3
N$19
  Top 0.254: R4.1 34.85,4.3 38.24,4.3 JP3.2
N$20
  Top 0.254: LED3.A 15.95,60.27 11.05,55.37 11.05,38.35 9.78,37.08 R31.1
RELAY_ON  (via drill 0.6)
  Top 0.305: Q2.1 90.6,17.69 v90.6,18.6
  Bottom 0.254: 4.5,63 4.55,63.05 4.55,63.17 9.98,68.6 10.1,68.6
  Bottom 0.305: v90.6,18.6 92.1,20.1 92.1,57.8 85.1,64.8 85.1,67.3 83.8,68.6 10.1,68.6 | 4.5,63 4.5,51.7 4.17,51.37 U$6.2
RX1
  Top 0.254: GPS.1 30.2,50.52 33.02,53.34 33.02,66.7 31.8,67.92 10.03,67.92 5.35,63.23 4.52,62.41 4.12,62.41 1.4,59.69 1.4,58.17 3.11,56.45 U$6.0
RX2
  Top 0.254: 14.54,57.95 17.14,60.56 17.14,63.63 15.71,65.06 BT.2
  Top 0.305: U$6.9 3.38,33.62 7.25,33.62 11.6,37.96 11.6,55.01 14.54,57.95
S0  (via drill 0.4)
  Top 0.254: U$11.10 38.26,19.26 39.2,20.2 39.2,21.9 37.2,23.9 35.5,23.9 v35.2,24.2 | v25.3,28.2 21.44,28.2 U$6.15/A1
  Bottom 0.254: v35.2,24.2 29.3,24.2 v25.3,28.2
S1  (via drill 0.4)
  Top 0.254: U$11.11 39.53,19.13 40.1,19.7 40.1,22.3 36.8,25.6 v33.9,25.6 | v24,29.2 22.98,29.2 U$6.16/A2
  Bottom 0.254: v33.9,25.6 29.5,25.6 25.9,29.2 v24,29.2
S2  (via drill 0.4)
  Top 0.254: U$6.17/A3 24.72,30 v25.2,30 | U$11.14 39.53,30 28.2,30 v28.2,30.1
  Bottom 0.254: v28.2,30.1 27.8,29.8 25.5,29.8 25.3,30 v25.2,30
S3  (via drill 0.35, 0.4)
  Top 0.254: U$11.13 40.8,30.6 40.5,30.9 v29.1,30.9 | v26.4,31.1 25,31.1 20.07,36.03 20.07,36.96 19.76,37.26 15.24,37.26 14.15,37.26 | 14.15,37.26 | U$6.20/A6 20.07,45.23 20.07,46.61 19.18,47.5 18.16,47.5 13.41,42.74 v13.41,41.25 | v13.41,40.01 13.41,38 14.15,37.26
  Bottom 0.254: v26.4,31.1 26.6,30.9 v29.1,30.9 | v13.41,40.01 v13.41,41.25
SCK
  Top 0.305: SD.4 10.36,23.36 11,24 16.62,24 U$6.13
  Bottom 0.254: NRF24.5 10.36,16.69 SD.4
SCL
  Top 0.254: 43.18,41.47 40.97,41.47 38.29,41.47 35.56,44.2 35.56,52.46 I2C_1.2 I2C_2.2 | 43.18,41.47 IC4.5 | U$6.19/A5 22.97,36.83 39.43,36.83 IMU.2 41.31,39.6 43.18,41.47
  Top 0.305: R32.1 18.38,41 U$6.19/A5
SD_CS  (via drill 0.4)
  Top 0.254: U$6.6 6.67,41.21 7.87,40.01 7.87,35.47 6.94,34.54 v6.18,34.54
  Top 0.305: SD.1 16.12,23 v15,23 | v14.8,25.31 14.8,27.8 13.8,28.8 7.7,28.8 6.2,30.3 v6.2,32.1
  Bottom 0.305: v15,23 14.8,23.2 v14.8,25.31 | v6.2,32.1 6.18,32.12 v6.18,34.54
SDA
  Top 0.254: U$6.18/A4 20.24,38.67 22.59,36.32 41.46,36.32 IMU.1 43.85,38.95 45.7,40.8 45.7,41.8 45.53,41.97 IC4.4 38.67,41.97 36.2,44.45 36.2,47.59 I2C_1.1 I2C_2.1
  Top 0.305: R33.1 18.26,39 U$6.18/A4
THERMISTOR  (via drill 0.35)
  Top 0.254: TEMP.2 47.24,60.2 46.48,60.96 46.48,66.42 45.09,67.82 34.67,67.82 33.66,66.8 33.66,48.9 31.62,46.86 v23.75,46.86 | v21.34,46.86 20.56,46.86 18.47,48.95
  Top 0.305: R34.1 18.42,49 18.47,48.95 U$6.22/A8
  Bottom 0.254: v23.75,46.86 v21.34,46.86
TX1
  Top 0.254: U$6.1 4.83,55.39 4.83,57.02 4.06,57.78 2.67,57.78 2.03,58.42 2.03,59.56 2.98,60.52 3.3,60.83 3.94,60.83 10.41,67.31 31.62,67.31 32.51,66.42 32.51,56.71 GPS.2
TX2
  Top 0.254: BT.1 17.91,65.37 17.91,60.2 12.19,54.48 12.19,37.69
  Top 0.305: U$6.10 5.4,33.1 7.6,33.1 12.19,37.69
V_BAT
  Top 0.254: R1.1 60,42.5 56.35,42.5 R2.1 54.65,40.8 51.6,40.8 50.8,41.6 50.8,42.1 50.43,42.47 IC4.8
  Top 1.27: C3.1 58.8,39 R1.1
  pour Top (isolate 0.305, no thermals): 58,42 58,39 78,39 78,44 64,44 62,42
VCC  (via drill 0.4)
  Top 0.254: IC4.6 48.15,40.65 C8.1 | C4.1 27.22,40.62 BRAKE.4
  Top 0.305: R29.2 14.15,54.55 U$6.VIN
  Top 0.406: 2.4,52.6 4.6,52.6 | 3.68,17.19 6.25,19.76 18.24,19.76 v19,19 | v25,21 24.3,21.7 U$12.5 24.3,24.6 C9.1 26.83,27.93 U$11.24 26.9,28.28 26.9,30 28.8,31.9 33.02,31.9 38.4,31.9 38.4,32.9 40.82,35.32 44.47,35.32 C8.1 | U$6.VIN 18.53,59.05 18.54,59.05 22.86,59.05 | 22.86,55.88 24.34,54.4 GPS.4 | BRAKE.4 22.86,42.54 22.86,55.88 | HALL.4 28.17,58.17 25.02,58.17 24.13,59.05 22.86,59.05 | 22.86,59.05 22.86,55.88
  Top 0.61: 2.4,52.6 1.2,51.4 1.2,19.8 3.68,17.32 3.68,17.19 IC1.OUT | 4.6,52.6 6.6,52.6 v10.06,56.06
  Bottom 0.254: C10.1 GPS.4 | C5.1 30.2,59.32 HALL.4
  Bottom 0.406: v19,19 21,21 v25,21 | BT.4 10.63,56.63 v10.06,56.06
  Bottom 0.61: U$6.VIN 17,57.4 11.4,57.4 v10.06,56.06

### Text on the board
tPlace: HALL | OUT+ | OUT- | GPS | 12V | 12V REG | BRAKE | FUSE | 12V FUSE | 5V REG | BAT1-2 | IN+ | IN-
bPlace: HC-06 | BMS | ITERA Kukang Team / Aug 2022 by Speeditera / KMHE 2022 | IMU | SD
Reference: I kept these separate to keep / the CAN line path linear